# EAGLE design CC2530-Testboard-USBCP2102-V01-008 (EAGLE 9.5.1)
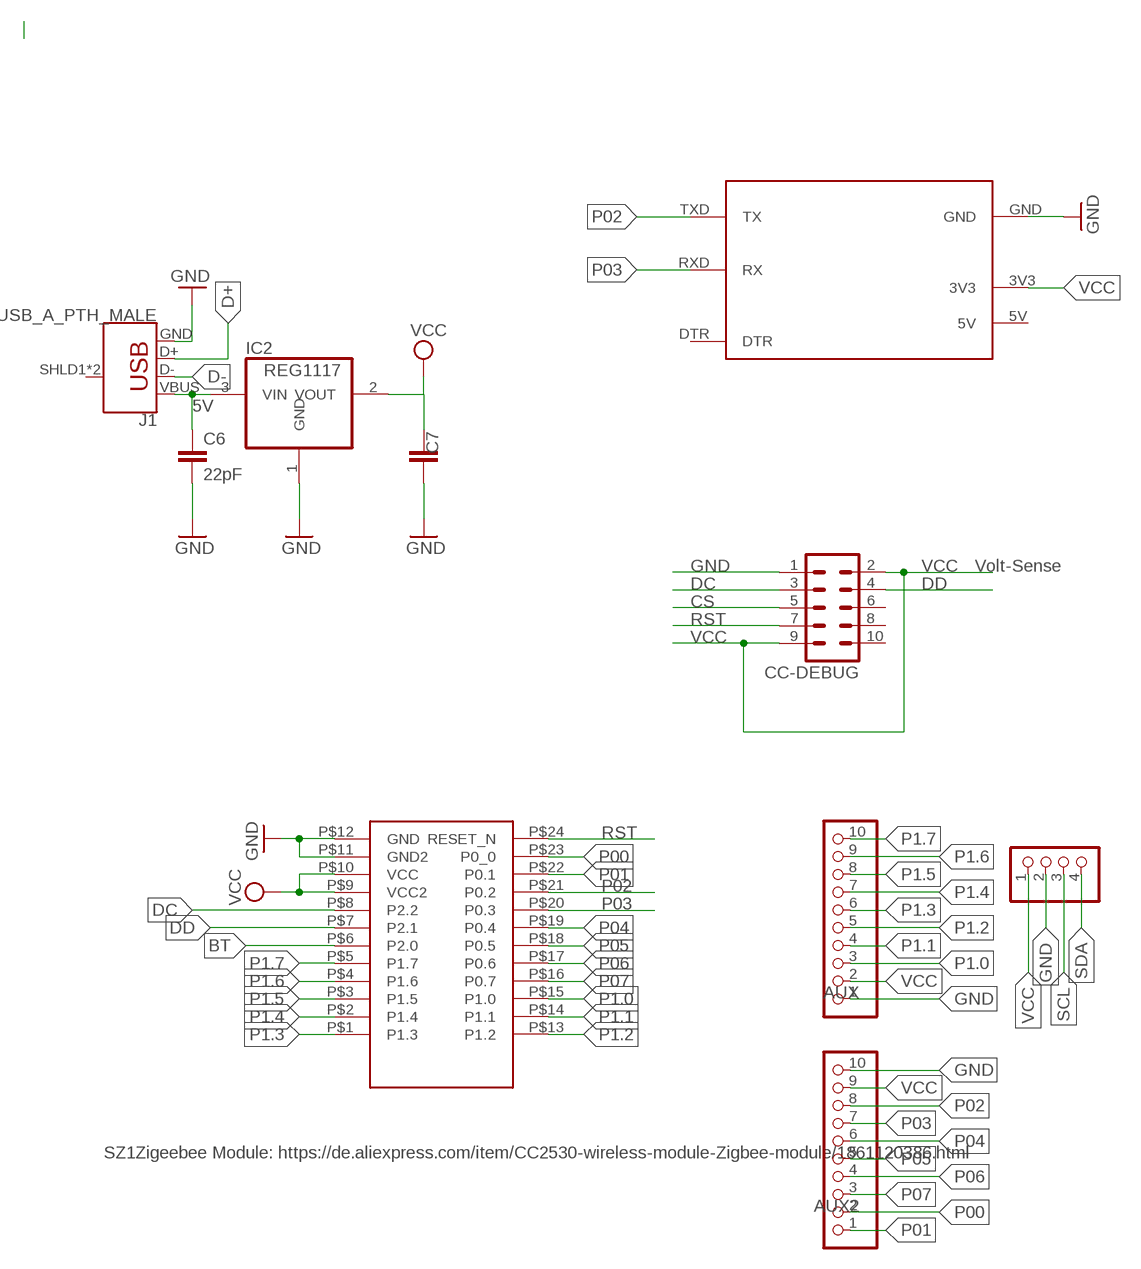
[diagram p0: schematic, sheet 1]

## Parts
AUX  PINHD-1X10_2.54-SMD-90°  [1X10SMD/90]
AUX2  PINHD-1X10_2.54-SMD-90°  [1X10SMD/90]
BH1750  PINHD-1X04_2.54-S  [1X04-S]
C6  22pF  C-EUC0805  [C0805]
C7  C-EUC1812  [C1812]
CC-DEBUG  MA05-2  [MA05-2]
IC2  REG1117  [SOT223]
J1  USB_A_PTH_MALE  [USB-A-H]
U$1  CC2530  [SZ1ZIGBEE-SMD]
U$2  CP2101  [CP2101-BEAKOUT]

## Nets
5V [PWR]: C6.1 IC2.3(VIN) J1.VBUS
BT: U$1.P$6(P2.0)
CS: CC-DEBUG.5
D+: J1.D+
D-: J1.D-
DC: CC-DEBUG.3 U$1.P$8(P2.2)
DD: CC-DEBUG.4 U$1.P$7(P2.1)
GND [PWR]: AUX2.10 AUX.1 BH1750.2 C6.2 C7.1 CC-DEBUG.1 IC2.1(GND) J1.GND U$1.P$11(GND2) U$1.P$12(GND) U$2.GND
P00: AUX2.2 U$1.P$23(P0_0)
P01: AUX2.1 U$1.P$22(P0.1)
P1.0: AUX.3 U$1.P$15(P1.0)
P1.1: AUX.4 U$1.P$14(P1.1)
P1.2: AUX.5 U$1.P$13(P1.2)
P1.3: AUX.6 U$1.P$1(P1.3)
P1.4: AUX.7 U$1.P$2(P1.4)
P1.5: AUX.8 U$1.P$3(P1.5)
P1.6: AUX.9 U$1.P$4(P1.6)
P1.7: AUX.10 U$1.P$5(P1.7)
P02: AUX2.8 U$1.P$21(P0.2) U$2.TXD(TX)
P03: AUX2.7 U$1.P$20(P0.3) U$2.RXD(RX)
P04: AUX2.6 U$1.P$19(P0.4)
P05: AUX2.5 U$1.P$18(P0.5)
P06: AUX2.4 U$1.P$17(P0.6)
P07: AUX2.3 U$1.P$16(P0.7)
RST: CC-DEBUG.7 U$1.P$24(RESET_N)
SCL: BH1750.3
SDA: BH1750.4
VCC [PWR]: AUX2.9 AUX.2 BH1750.1 C7.2 CC-DEBUG.2 CC-DEBUG.9 IC2.2(VOUT) U$1.P$9(VCC2) U$1.P$10(VCC) U$2.3V3
Unconnected: CC-DEBUG.6 CC-DEBUG.8 CC-DEBUG.10 J1.SHLD1(SHIELD) J1.SHLD2(SHIELD) U$2.DTR

## Notes on the sheet
- Volt-Sense
- SZ1Zigeebee Module: https://de.aliexpress.com/item/CC2530-wireless-module-Zigbee-module/1861120386.html

## Power pins joined to a net without a drawn wire
5V: U$2.5V

## Library data of the parts
AUX AUX2 = pinhead-2:PINHD-1X10: PIN HEADER
BH1750 = pinhead-2:PINHD-1X04: PIN HEADER
C6 C7 = rcl:C-EU: CAPACITOR, European symbol; SPICEPREFIX: C
CC-DEBUG = con-lstb:MA05-2: PIN HEADER; OC_FARNELL: unknown; OC_NEWARK: unknown
IC2 = burr-brown:REG1117: 800mA and 1A Low Dropout (LDO) Positive Regulator 1.8V, 2.5V, 2.85V, 3.3V, 5V, and Adj; MPN: REG1117; OC_FARNELL: 1097566; OC_NEWARK: 14P6981
J1 = SparkFun-Connectors:USB_A: USB-A Connector Male and female variants, as well as PTH and SMT variants SparkFun Products: SparkFun XBee Explorer Dongle <https://www.sparkfun.com/products/11697> PTH Male SparkFun MicroView-USB Programmer <https://www.sparkfun.com/products/12924> SMT Male SparkFun USB Type A Female Breakout <https://www.sparkfun.com/products/12700> SMT Female; PROD_ID: CONN-08367; SF_ID: PRT-00437
U$1 = zigbee:CC2530: CC2530 Wireless Zigbee Module 3.0-3.6V 2.405-2.485GHz SMD Pads !
U$2 = Martin-USB-V001:CP2101

## Net classes
0 default: width 0.305 mm
1 PWR: width 0.61 mm

## Board
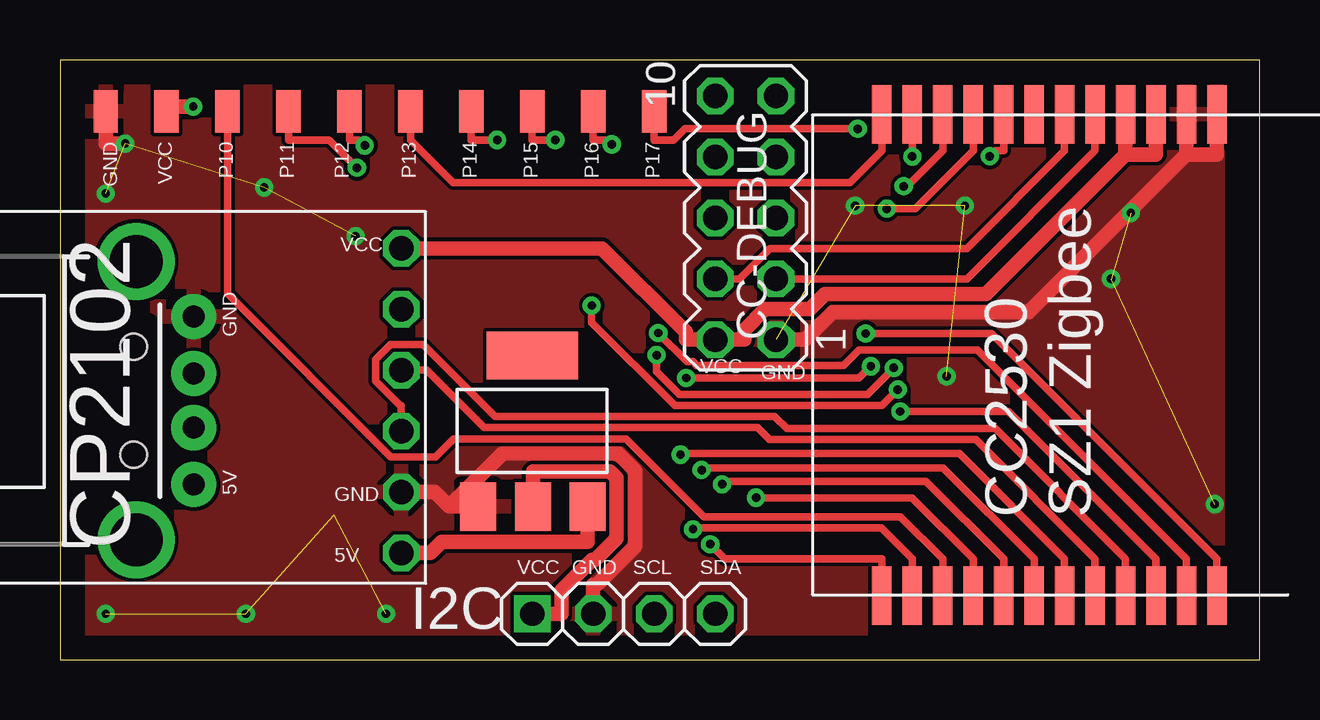
[diagram p1: board, top side]
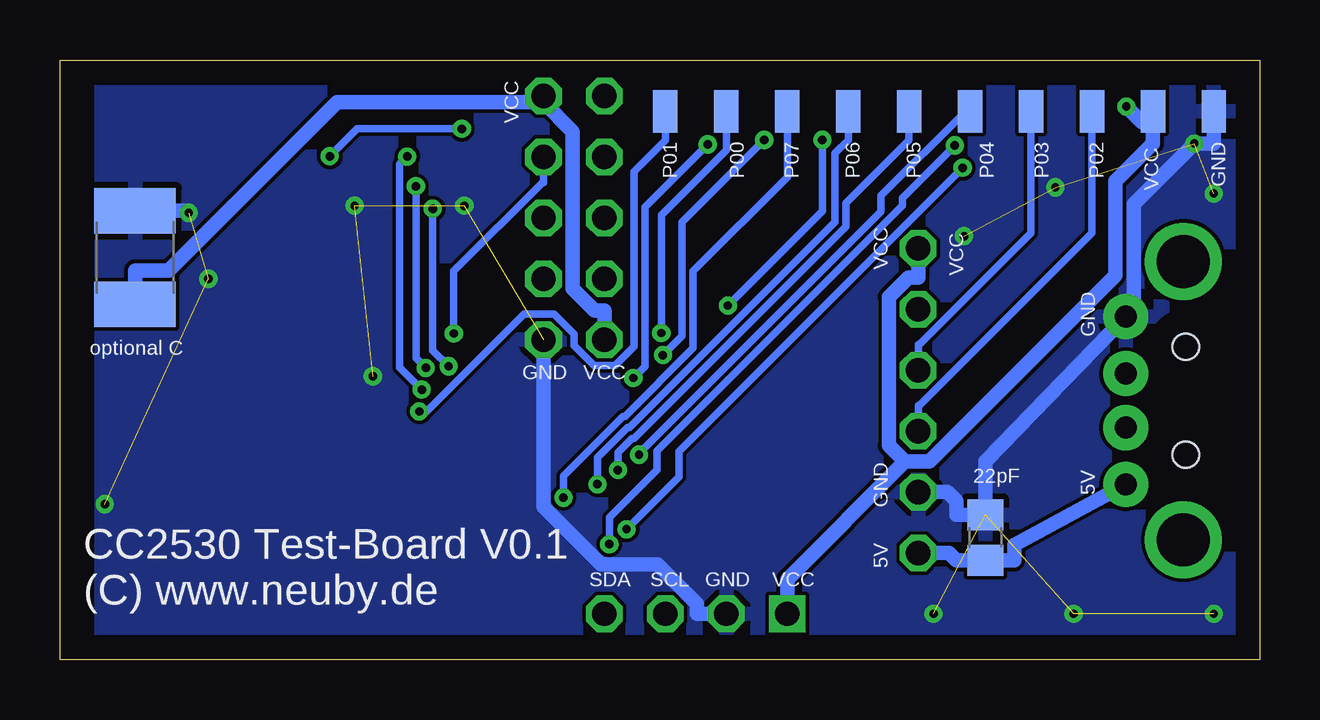
[diagram p2: board, bottom side, seen from below]

Size 50 x 25 mm. Coordinates in mm from the lower left corner, seen from the top.
Outline: 0,0 50,0 50,25 0,25 0,0
Copper layers (1*16): Top 0.035mm / dielectric 1.5mm / Bottom 0.035mm
Design rules "default": minimum track width 6mil, minimum drill 0.35mm, track to track 6mil, track to pad 6mil, pad to pad 6mil, via to via 6mil, smd to smd 6mil, copper to edge 40mil, drill to drill 6mil, minimum pad ring 10mil, minimum via ring 8mil, stop-mask expansion 4mil, vias tented up to drill 0mil, thermal gap 10mil

### Footprints (pad centres in the part's own frame; a part is rotated, then mirrored left to right if it is on the bottom)
1X10SMD/90 = smd 1.016 x 1.778: 1 -1.27,-5.08; 2 1.27,-5.08; 3 3.81,-5.08; 4 6.35,-5.08; 5 8.89,-5.08; 6 11.43,-5.08; 7 13.97,-5.08; 8 16.51,-5.08; 9 19.05,-5.08; 10 21.59,-5.08
1X04-S = drill 1.016 square: 1 -3.81,0 | drill 1.016 octagon: 2 -1.27,0; 3 1.27,0; 4 3.81,0
C0805 = smd 1.3 x 1.5: 1 -0.95,0; 2 0.95,0
C1812 = smd 1.9 x 3.4: 1 -1.95,0; 2 1.95,0
MA05-2 = drill 1.016 octagon: 1 -5.08,-1.27; 2 -5.08,1.27; 3 -2.54,-1.27; 4 -2.54,1.27; 5 0,-1.27; 6 0,1.27; 7 2.54,-1.27; 8 2.54,1.27; 9 5.08,-1.27; 10 5.08,1.27
SOT223 = smd 1.499 x 2.007: 1 -2.261,-3.15; 2 0.025,-3.15; 3 2.311,-3.15 | smd 3.81 x 2.007: 4 0,3.15
USB-A-H = drill 0.914 pad 1.88: D+ 2.4,1.127; D- 2.4,-1.127; GND 2.4,3.5; VBUS 2.4,-3.5 | drill 2.2: SHLD1 0,-5.8; SHLD2 0,5.8 | hole 1.1: -0.1,2.25; -0.1,-2.25
SZ1ZIGBEE-SMD = smd 2.438 x 0.813: P$1 -10.036,-12.101; P$2 -10.036,-10.831; P$3 -10.036,-9.561; P$4 -10.036,-8.291; P$5 -10.036,-7.021; P$6 -10.036,-5.751; P$7 -10.036,-4.481; P$8 -10.036,-3.211; P$9 -10.036,-1.941; P$10 -10.036,-0.671; P$11 -10.036,0.599; P$12 -10.036,1.869; P$13 10.03,-12.101; P$14 10.03,-10.831; P$15 10.03,-9.561; P$16 10.03,-8.291; P$17 10.03,-7.021; P$18 10.03,-5.751; P$19 10.03,-4.481; P$20 10.03,-3.211; P$21 10.03,-1.941; P$22 10.03,-0.671; P$23 10.03,0.599; P$24 10.03,1.869
CP2101-BEAKOUT = drill 1.016 octagon: 3V3 13.97,1.016; 5V 1.27,1.016; DTR 11.43,1.016; GND 3.81,1.016; RXD 8.89,1.016; TXD 6.35,1.016

### Placement (x,y rotation side)
AUX  3.17,27.94 0 top
AUX2  23.5,27.94 0 bottom
BH1750  23.5,1.91 0 top
C6  11.43,5.08 90 bottom
C7  46.87,16.77 270 bottom
CC-DEBUG  28.57,18.41 90 top
IC2  19.68,9.53 0 top
J1  3.17,10.79 0 top
U$1  46.35,12.7 270 top
U$2  15.24,3.17 90 top

### Tracks (layer width: path | path; a pad name or v marks a point on that pad's centre or on a via)
5V
  Top 0.61: U$2.5V 15.44,4.45 15.91,4.92 22,4.92 IC2.3
  Bottom 0.61: U$2.5V 12.95,4.45 12.64,4.13 C6.1 10.22,4.13 10.22,4.78 J1.VBUS
DC
  Top 0.305: CC-DEBUG.3 37.81,15.88 43.14,21.21 U$1.P$8
DD
  Top 0.305: CC-DEBUG.4 28.37,15.88 28.37,15.92 29.6,17.14 37.81,17.14 41.87,21.21 U$1.P$7
GND  (via drill 0.35 pad 0.76)  (11 unrouted)
  Top 0.61: 16.22,6.38 18.44,8.6 23.25,8.6 23.96,7.88 23.96,4.73 22.36,3.12 22.23,3.12 BH1750.2 | 16.22,6.38 15.61,6.99 U$2.GND | 44.58,18.68 40.38,14.48 32.21,14.48 31.06,13.34 CC-DEBUG.1 | IC2.1 16.22,6.38 | 46.95,21.06 44.58,18.68 | 44.58,18.68 v44.63,18.62 | 46.95,21.06 48.22,21.06 U$1.P$12 | U$1.P$11 46.95,21.06 | v2.72,21.51 1.91,21.51 AUX2.10
  Bottom 0.61: U$2.GND 13.01,6.99 12.64,6.62 12.64,6.03 C6.2 11.43,8.26 J1.GND 5.24,14.63 5.24,18.99 v2.72,21.51 1.91,21.51 AUX2.10 | CC-DEBUG.1 29.84,12.12 29.85,12.11 29.85,6.37 27.45,3.97 25.1,3.97 23.44,2.31 23.44,1.91 BH1750.2 | C7.1 44.71,18.71 44.71,18.7 v44.63,18.62
  other vias: 1.91,1.91 13.59,1.91 1.91,19.43 8.51,19.68 12.32,17.65 33.15,18.92 37.72,18.92 36.96,11.81 48.13,6.48 43.81,15.88 7.75,1.91
  pour Top: 0.64,24.13 48.26,24.13 48.26,0.64 0.64,0.64
  pour Bottom: 0.64,24.13 48.26,24.13 48.26,0.64 0.64,0.64
P00  (via drill 0.35 pad 0.76)
  Top 0.305: v24.94,13.62 26.13,12.42 26.39,12.42 26.54,12.27 32.66,12.27 33.31,12.91 38.23,12.91 46.95,4.19 U$1.P$23
  Bottom 0.305: v24.94,13.62 24.94,18.54 22.23,21.25 22.23,21.67 AUX2.2
P01  (via drill 0.35 pad 0.76)
  Top 0.305: v35.03,10.35 39.53,10.35 45.68,4.19 U$1.P$22
  Bottom 0.305: v35.03,10.35 34.72,10.35 30.66,14.4 29.4,14.4 28.57,13.58 28.57,13.1 27.74,12.26 26.87,12.26 26.08,13.05 26.08,20.35 24.77,21.67 AUX2.1
P1.0
  Top 0.305: U$1.P$15 36.79,4.19 35.04,5.95 26.85,5.95 23.6,9.21 16.42,9.21 15.67,8.46 13.78,8.46 6.99,15.25 AUX.3
P1.1  (via drill 0.35 pad 0.76)
  Top 0.305: v26.38,5.43 26.44,5.49 34.23,5.49 35.52,4.19 U$1.P$14 | v12.37,20.51 11.21,21.67 9.53,21.67 AUX.4
  Bottom 0.305: v26.38,5.43 24.19,7.62 24.19,8.69 v12.37,20.51
P1.2  (via drill 0.35 pad 0.76)
  Top 0.305: v27.1,4.8 27.71,4.19 34.25,4.19 U$1.P$13 | v12.7,21.43 12.47,21.67 12.06,21.67 AUX.5
  Bottom 0.305: v12.7,21.43 14.89,19.25 14.89,18.92 25.11,8.69 25.11,7.91 27.1,5.92 v27.1,4.8
P1.3
  Top 0.305: AUX.6 14.61,21.67 16.38,19.89 32.93,19.89 34.25,21.21 U$1.P$1
P1.4  (via drill 0.35 pad 0.76)
  Top 0.305: v34.92,11.25 34.27,10.6 25.63,10.6 22.16,14.06 v22.16,14.76 | v35.52,20.97 35.52,21.21 U$1.P$2 | v18.22,21.67 17.14,21.67 AUX.7
  Bottom 0.305: v22.16,14.76 18.22,18.7 v18.22,21.67 | v35.52,20.97 35.85,20.65 35.85,12.18 v34.92,11.25
P1.5  (via drill 0.35 pad 0.76)
  Top 0.305: v34.76,12.16 33.65,11.05 25.82,11.05 24.87,12.01 v24.87,12.69 | v35.17,19.73 35.32,19.73 36.79,21.21 U$1.P$3 | v20.65,21.67 19.68,21.67 AUX.8
  Bottom 0.305: v24.87,12.69 24.07,13.49 24.07,18.25 v20.65,21.67 | v35.17,19.73 35.17,12.57 v34.76,12.16
P1.6  (via drill 0.35 pad 0.76)
  Top 0.305: v33.8,12.23 33.31,11.74 v26.1,11.74 | v34.46,18.8 35.65,18.8 38.06,21.21 U$1.P$4 | v23,21.48 22.81,21.67 22.23,21.67 AUX.9
  Bottom 0.305: v23,21.48 25.62,18.86 25.62,12.22 v26.1,11.74 | v34.46,18.8 34.46,12.89 v33.8,12.23
P1.7  (via drill 0.35 pad 0.76)
  Top 0.305: v33.25,22.13 26.05,22.13 25.58,21.67 24.77,21.67 AUX.10 | v38.76,20.98 38.98,21.21 39.33,21.21 U$1.P$5
  Bottom 0.305: v38.76,20.98 37.61,22.13 v33.25,22.13
P02
  Top 0.305: U$1.P$21 44.41,4.19 38.98,9.63 30.3,9.63 29.79,10.14 18.13,10.14 15.14,13.13 13.78,13.13 13.16,12.51 13.16,11.62 14.18,10.59 14.22,10.59 U$2.TXD
  Bottom 0.305: U$2.TXD 14.22,10.59 14.18,10.59 6.99,17.79 AUX2.8
P03
  Top 0.305: U$1.P$20 43.14,4.19 38.17,9.17 29.58,9.17 29.06,9.68 17.67,9.68 15.29,12.06 U$2.RXD
  Bottom 0.305: AUX2.7 9.53,17.79 14.18,13.13 14.22,13.13 U$2.RXD
P04  (via drill 0.35 pad 0.76)
  Top 0.305: U$1.P$19 41.87,4.19 37.48,8.59 25.91,8.59 v25.86,8.54
  Bottom 0.305: v25.86,8.54 25.86,8.59 15.77,18.68 15.77,19.34 12.25,22.86 AUX2.6
P05  (via drill 0.35 pad 0.76)
  Top 0.305: v26.74,7.9 26.83,7.99 36.81,7.99 40.6,4.19 U$1.P$18
  Bottom 0.305: v26.74,7.9 26.74,8.63 26.15,9.23 26.07,9.23 17.25,18.05 17.25,19.02 14.61,21.67 AUX2.5
P06  (via drill 0.35 pad 0.76)
  Top 0.305: v27.6,7.3 27.73,7.43 36.09,7.43 39.33,4.19 U$1.P$17
  Bottom 0.305: v27.6,7.3 27.6,8.42 26.34,9.68 26.26,9.68 17.7,18.24 17.7,21.11 17.14,21.67 AUX2.4
P07  (via drill 0.35 pad 0.76)
  Top 0.305: v29.02,6.75 35.51,6.75 38.06,4.19 U$1.P$16
  Bottom 0.305: v29.02,6.75 29.02,7.65 26.53,10.14 26.45,10.14 23.61,12.98 23.61,16.19 19.68,20.11 AUX2.3
RST  (via drill 0.35 pad 0.76)
  Top 0.305: v33.58,13.6 38.82,13.6 48.22,4.19 U$1.P$24
  Bottom 0.305: v33.58,13.6 33.58,16.19 29.89,19.89 29.84,19.89 CC-DEBUG.7
VCC  (via drill 0.35 pad 0.76)
  Top 0.61: AUX2.9 4.64,23.06 v5.55,23.06 | U$2.3V3 14.83,17.14 15.44,17.14 22.59,17.14 26.09,13.65 26.09,13.34 CC-DEBUG.2 28.52,13.34 28.52,13.74 29.38,14.61 31.26,14.61 31.89,15.24 38.6,15.24 44.41,21.06 | IC2.2 19.71,7.84 22.94,7.84 23.2,7.57 23.2,5.04 22.31,4.15 22.17,4.15 20.9,2.89 20.9,1.91 BH1750.1 | 44.41,21.06 45.68,21.06 U$1.P$10 | U$1.P$9 44.41,21.06
  Bottom 0.61: 4.45,22.41 4.91,22.41 v5.55,23.06 | 4.45,22.41 4.45,21.51 6.02,19.94 6.02,16 13.77,8.26 14.78,8.26 | AUX2.9 4.45,22.41 | 14.78,8.26 15.45,8.93 15.45,15.11 14.63,15.93 14.22,15.93 U$2.3V3 | 14.78,8.26 19.68,3.35 BH1750.1 | C7.2 46.87,16.22 45.46,16.22 38.45,23.23 29.84,23.23 | 29.84,23.23 28.63,22.01 28.63,15.46 27.71,14.55 27.3,14.55 CC-DEBUG.2 | CC-DEBUG.9 29.84,23.23

### Text on the board
tNames: GND | VCC | P10 | P11 | P12 | P13 | P14 | P15 | P16 | P17 | VCC | GND | VCC | GND | 5V | GND | 5V | VCC | GND | SCL | SDA | I2C
bNames: VCC | GND | P02 | P03 | P04 | P05 | P06 | P07 | P00 | P01 | VCC | VCC | VCC | GND | optional C | VCC | GND | 5V | 22pF | GND | 5V | VCC | GND | SCL | SDA | CC2530 Test-Board V0.1 / (C) www.neuby.de